# Altium schematic sheet amg8833.SchDoc
size A2
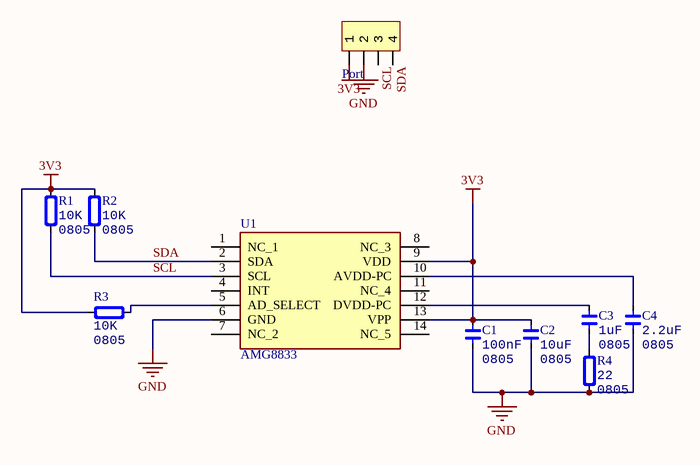
[diagram p0: amg8833.SchDoc]

## Parts
C1  value 100nF  Type: 0805  [CAP_0805]  (hidden comment: C0805)
C2  value 10uF  Type: 0805  [CAP_0805]  (hidden comment: C0805)
C3  value 1uF  Type: 0805  [CAP_0805]  (hidden comment: C0805)
C4  value 2.2uF  Type: 0805  [CAP_0805]  (hidden comment: C0805)
Port  HDR1x4_2.54  [HDR1x4_2.54_180]  (value not drawn)
R1  value 10K  Type: 0805  [RES_0805]  (hidden comment: R0805)
R2  value 10K  Type: 0805  [RES_0805]  (hidden comment: R0805)
R3  value 10K  Type: 0805  [RES_0805]  (hidden comment: R0805)
R4  value 22  Type: 0805  [RES_0805]  (hidden comment: R0805)
U1  AMG8833  [AMG8833]

## Nets
3V3: C1.2 C2.2 Port.1 R1.2 R2.2 R3.2 U1.9(VDD) U1.13(VPP)
GND: C1.1 C2.1 C4.1 Port.2 R4.1 U1.6(GND)
SCL: Port.3 R1.1 U1.3(SCL)
SDA: Port.4 R2.1 U1.2(SDA)
NetC3_1: C3.1 R4.2
NetC3_2: C3.2 U1.12(DVDD-PC)
NetC4_2: C4.2 U1.10(AVDD-PC)
NetR3_1: R3.1 U1.5(AD_SELECT)

Not connected (* = marked no-connect by the designer): U1 1(NC_1) 4(INT) 7(NC_2) 8(NC_3) 11(NC_4) 14(NC_5)

## Library data of the parts
C1-C4 = Cap_0805: Capacitor; Specification: X7R 50V; Manufacturer: *
Port = HDR1x4_2.54: Header
R1-R4 = Res_0805: Resistor; Specification: ±5%; Manufacturer: *